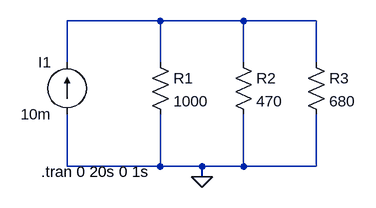
[diagram p0: schematic Kichroff Current.asc]
Kichroff Current.asc, the LTspice schematic file:
Version 4
SHEET 1 880 680
WIRE 320 -48 176 -48
WIRE 448 -48 320 -48
WIRE 560 -48 448 -48
WIRE 176 16 176 -48
WIRE 320 16 320 -48
WIRE 448 16 448 -48
WIRE 560 16 560 -48
WIRE 176 176 176 96
WIRE 320 176 320 96
WIRE 320 176 176 176
WIRE 384 176 320 176
WIRE 448 176 448 96
WIRE 448 176 384 176
WIRE 560 176 560 96
WIRE 560 176 448 176
WIRE 384 192 384 176
FLAG 384 192 0
SYMBOL res 304 0 R0
SYMATTR InstName R1
SYMATTR Value 1000
SYMBOL res 432 0 R0
SYMATTR InstName R2
SYMATTR Value 470
SYMBOL res 544 0 R0
SYMATTR InstName R3
SYMATTR Value 680
SYMBOL current 176 96 R180
WINDOW 0 24 80 Left 2
WINDOW 3 24 0 Left 2
SYMATTR InstName I1
SYMATTR Value 10m
TEXT 136 184 Left 2 !.tran 0 20s 0 1s

The netlist it stands for:
* Kichroff Current.asc
R1 N001 0 1000
R2 N001 0 470
R3 N001 0 680
I1 0 N001 10m
.tran 0 20s 0 1s
.backanno
.end